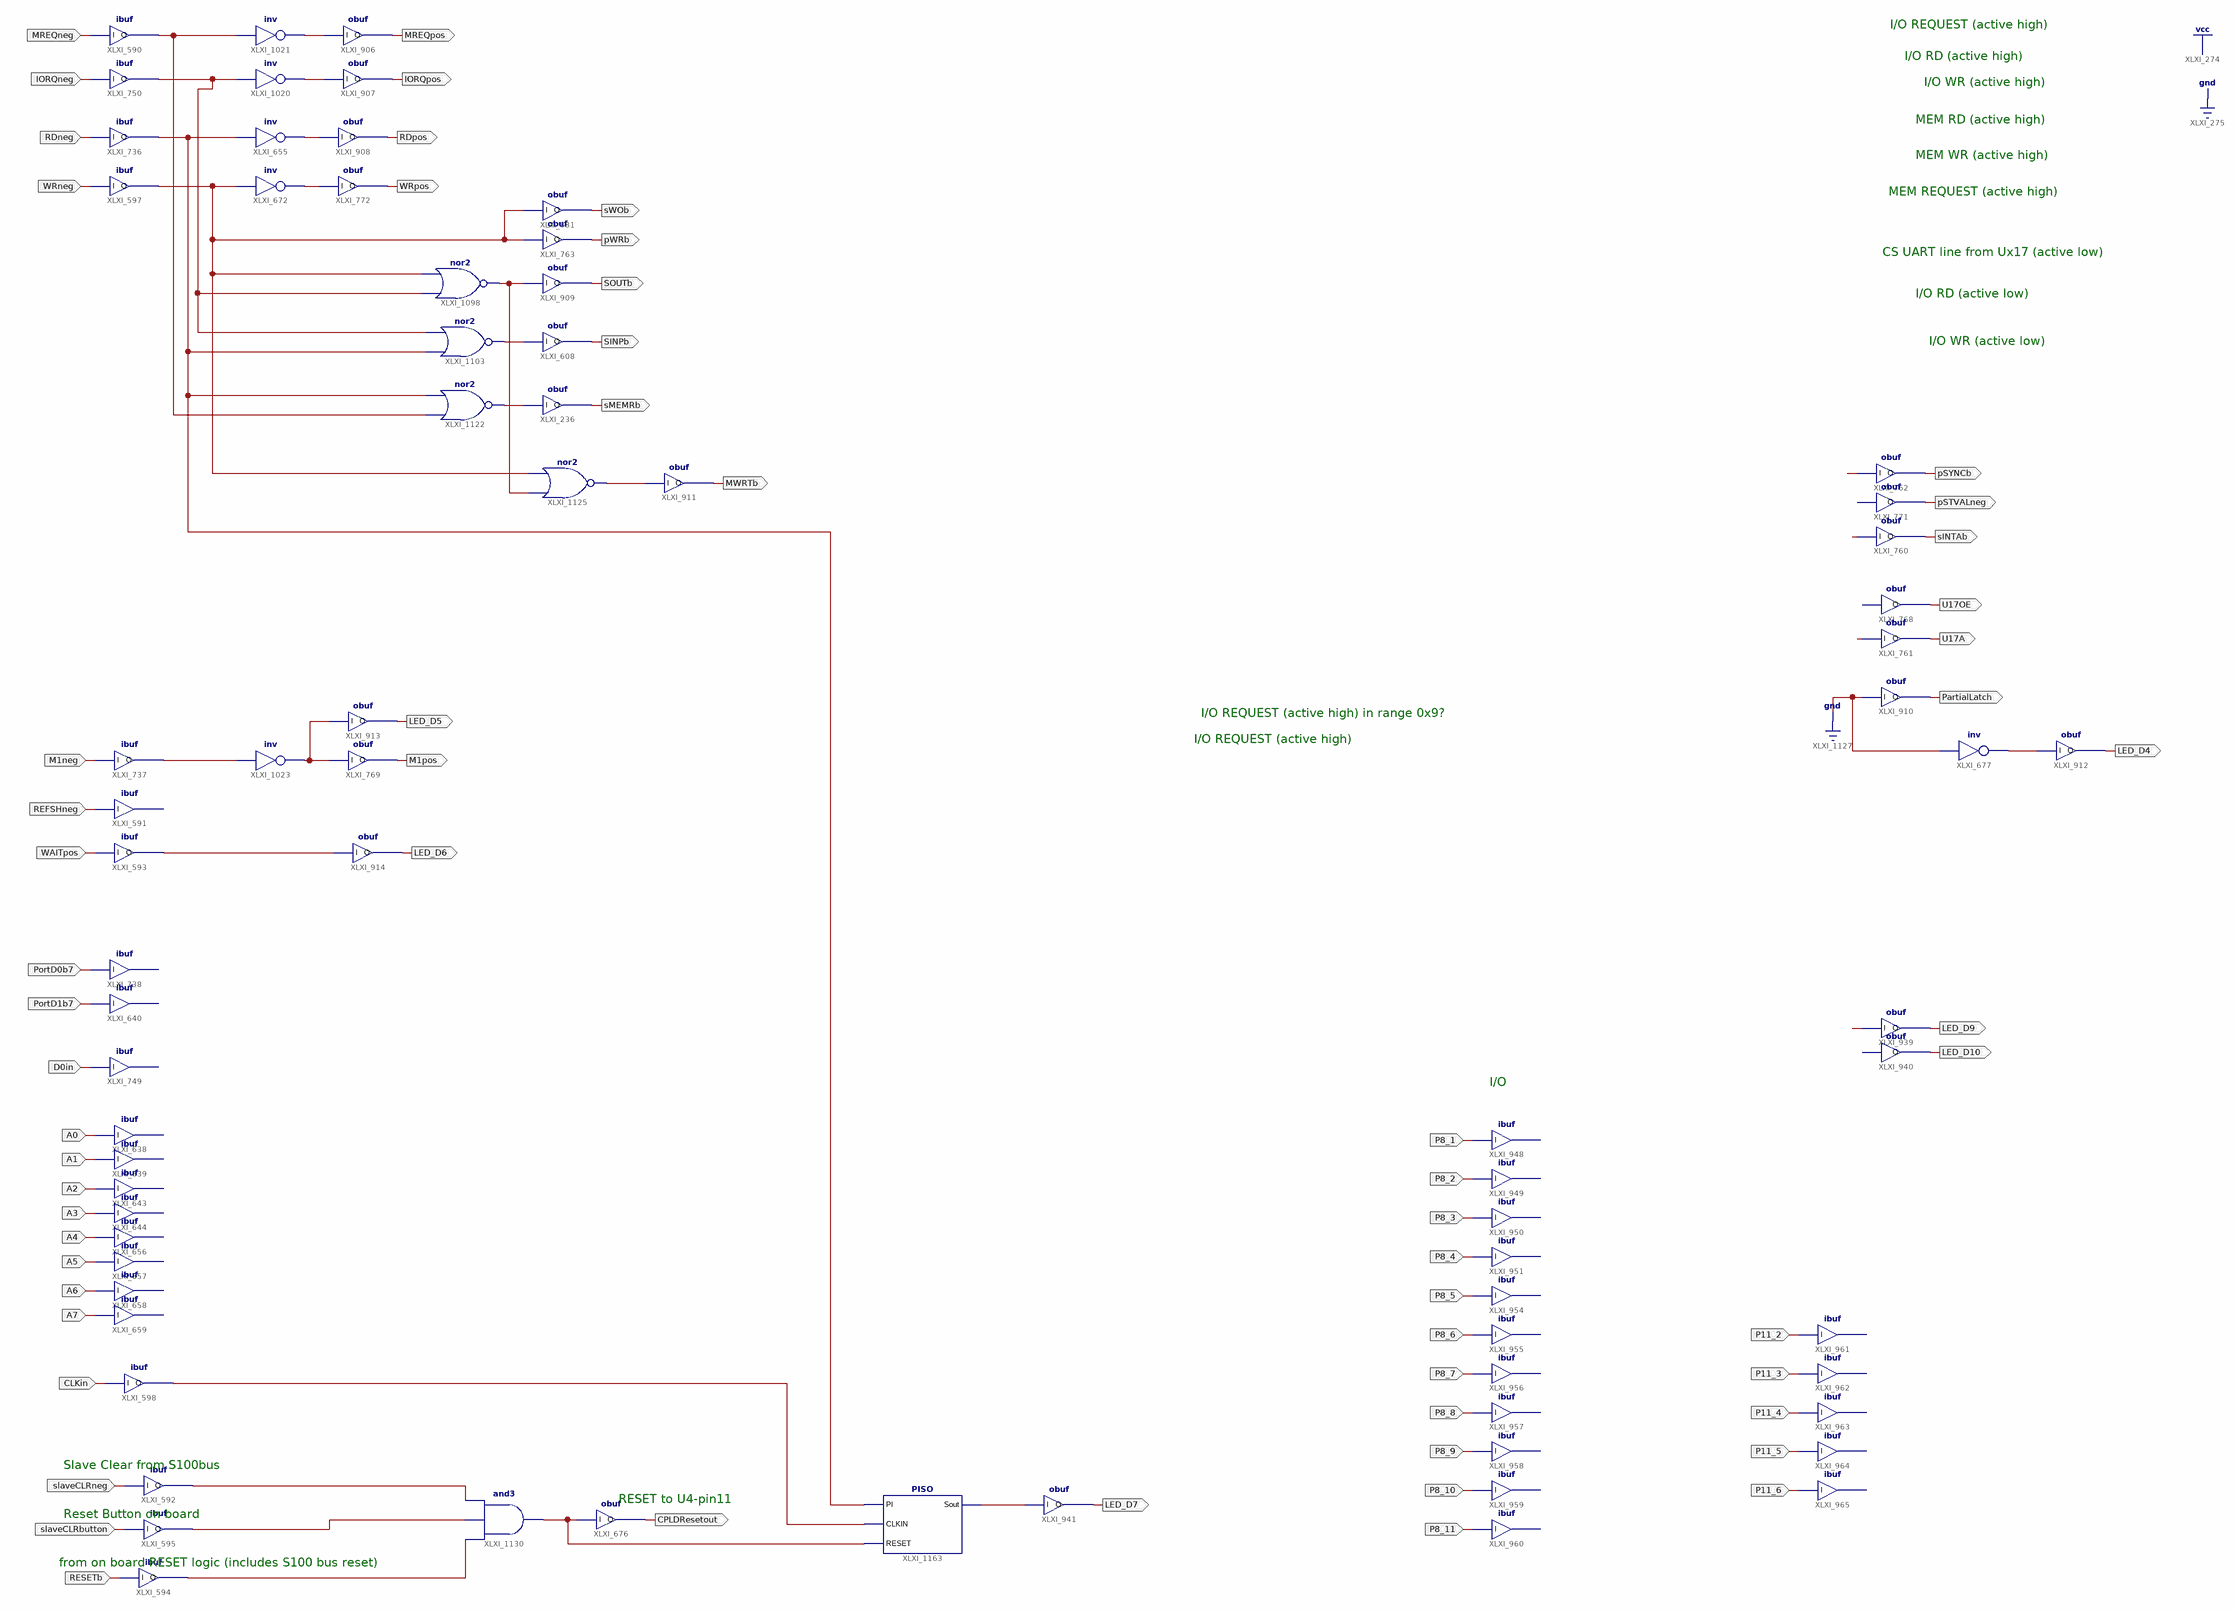
[diagram p0: schematic sheet 1]
// Xilinx ISE schematic IC1v1.sch (xc9500) as structural Verilog: 74 symbols, 62 ports
module IC1v1 (
  input  slaveCLRneg,
  input  slaveCLRbutton,
  input  RESETb,
  input  RDneg,
  input  IORQneg,
  input  WRneg,
  input  MREQneg,
  input  CLKin,
  input  A0,
  input  A1,
  input  A2,
  input  A3,
  input  A4,
  input  A5,
  input  A6,
  input  A7,
  input  D0in,
  input  PortD0b7,
  input  PortD1b7,
  input  M1neg,
  input  REFSHneg,
  input  WAITpos,
  input  P11_2,
  input  P11_3,
  input  P11_4,
  input  P11_5,
  input  P11_6,
  input  P8_1,
  input  P8_2,
  input  P8_3,
  input  P8_4,
  input  P8_5,
  input  P8_6,
  input  P8_7,
  input  P8_8,
  input  P8_9,
  input  P8_10,
  input  P8_11,
  output CPLDResetout,
  output PartialLatch,
  output LED_D9,
  output LED_D10,
  output RDpos,
  output WRpos,
  output MREQpos,
  output IORQpos,
  output pSYNCb,
  output pSTVALneg,
  output U17OE,
  output U17A,
  output sINTAb,
  output SOUTb,
  output SINPb,
  output M1pos,
  output sMEMRb,
  output pWRb,
  output MWRTb,
  output sWOb,
  output LED_D4,
  output LED_D5,
  output LED_D6,
  output LED_D7
);

  wire XLXN_1060, XLXN_1061, XLXN_1062, XLXN_1220, XLXN_1226, XLXN_1265, XLXN_1337, XLXN_1356, XLXN_1357,
       XLXN_1359, XLXN_1360, XLXN_1465, XLXN_1466, XLXN_1487, XLXN_1489, XLXN_1493, XLXN_1498, XLXN_1499,
       XLXN_1500, XLXN_1501, XLXN_1508, XLXN_1509, XLXN_1516, XLXN_1541, XLXN_1542, XLXN_1543;

  not XLXI_672 (XLXN_1359, XLXN_1498);
  not XLXI_655 (XLXN_1337, XLXN_1466);
  ibuf XLXI_592 (.I(slaveCLRneg), .O(XLXN_1499));
  ibuf XLXI_595 (.I(slaveCLRbutton), .O(XLXN_1500));
  obuf XLXI_676 (.I(XLXN_1542), .O(CPLDResetout));
  obuf XLXI_910 (.I(1'b0), .O(PartialLatch));
  obuf XLXI_939 (.I(XLXN_1265), .O(LED_D9));
  obuf XLXI_940 (.O(LED_D10));  // open: I
  not XLXI_677 (XLXN_1508, 1'b0);
  ibuf XLXI_594 (.I(RESETb), .O(XLXN_1501));
  ibuf XLXI_736 (.I(RDneg), .O(XLXN_1466));
  obuf XLXI_908 (.I(XLXN_1337), .O(RDpos));
  ibuf XLXI_750 (.I(IORQneg), .O(XLXN_1357));
  ibuf XLXI_597 (.I(WRneg), .O(XLXN_1498));
  obuf XLXI_772 (.I(XLXN_1359), .O(WRpos));
  obuf XLXI_906 (.I(XLXN_1356), .O(MREQpos));
  obuf XLXI_907 (.I(XLXN_1220), .O(IORQpos));
  not XLXI_1020 (XLXN_1220, XLXN_1357);
  not XLXI_1021 (XLXN_1356, XLXN_1487);
  ibuf XLXI_590 (.I(MREQneg), .O(XLXN_1487));
  obuf XLXI_762 (.I(XLXN_1062), .O(pSYNCb));
  obuf XLXI_771 (.O(pSTVALneg));  // open: I
  obuf XLXI_768 (.O(U17OE));  // open: I
  obuf XLXI_761 (.I(XLXN_1061), .O(U17A));
  obuf XLXI_760 (.I(XLXN_1060), .O(sINTAb));
  nor XLXI_1098 (XLXN_1493, XLXN_1357, XLXN_1498);
  obuf XLXI_909 (.I(XLXN_1493), .O(SOUTb));
  nor XLXI_1103 (XLXN_1465, XLXN_1466, XLXN_1357);
  obuf XLXI_608 (.I(XLXN_1465), .O(SINPb));
  ibuf XLXI_598 (.I(CLKin), .O(XLXN_1543));
  ibuf XLXI_638 (.I(A0));  // open: O
  ibuf XLXI_639 (.I(A1));  // open: O
  ibuf XLXI_643 (.I(A2));  // open: O
  ibuf XLXI_644 (.I(A3));  // open: O
  ibuf XLXI_656 (.I(A4));  // open: O
  ibuf XLXI_657 (.I(A5));  // open: O
  ibuf XLXI_658 (.I(A6));  // open: O
  ibuf XLXI_659 (.I(A7));  // open: O
  ibuf XLXI_749 (.I(D0in));  // open: O
  ibuf XLXI_738 (.I(PortD0b7));  // open: O
  ibuf XLXI_640 (.I(PortD1b7));  // open: O
  ibuf XLXI_737 (.I(M1neg), .O(XLXN_1360));
  obuf XLXI_769 (.I(XLXN_1509), .O(M1pos));
  not XLXI_1023 (XLXN_1509, XLXN_1360);
  ibuf XLXI_591 (.I(REFSHneg));  // open: O
  ibuf XLXI_593 (.I(WAITpos), .O(XLXN_1516));
  nor XLXI_1122 (XLXN_1489, XLXN_1487, XLXN_1466);
  obuf XLXI_236 (.I(XLXN_1489), .O(sMEMRb));
  obuf XLXI_763 (.I(XLXN_1498), .O(pWRb));
  nor XLXI_1125 (XLXN_1226, XLXN_1493, XLXN_1498);
  obuf XLXI_911 (.I(XLXN_1226), .O(MWRTb));
  obuf XLXI_581 (.I(XLXN_1498), .O(sWOb));
  and XLXI_1130 (XLXN_1542, XLXN_1501, XLXN_1500, XLXN_1499);
  obuf XLXI_912 (.I(XLXN_1508), .O(LED_D4));
  obuf XLXI_913 (.I(XLXN_1509), .O(LED_D5));
  obuf XLXI_914 (.I(XLXN_1516), .O(LED_D6));
  ibuf XLXI_961 (.I(P11_2));  // open: O
  ibuf XLXI_962 (.I(P11_3));  // open: O
  ibuf XLXI_963 (.I(P11_4));  // open: O
  ibuf XLXI_964 (.I(P11_5));  // open: O
  ibuf XLXI_965 (.I(P11_6));  // open: O
  ibuf XLXI_948 (.I(P8_1));  // open: O
  ibuf XLXI_949 (.I(P8_2));  // open: O
  ibuf XLXI_950 (.I(P8_3));  // open: O
  ibuf XLXI_951 (.I(P8_4));  // open: O
  ibuf XLXI_954 (.I(P8_5));  // open: O
  ibuf XLXI_955 (.I(P8_6));  // open: O
  ibuf XLXI_956 (.I(P8_7));  // open: O
  ibuf XLXI_957 (.I(P8_8));  // open: O
  ibuf XLXI_958 (.I(P8_9));  // open: O
  ibuf XLXI_959 (.I(P8_10));  // open: O
  ibuf XLXI_960 (.I(P8_11));  // open: O
  obuf XLXI_941 (.I(XLXN_1541), .O(LED_D7));
  PISO XLXI_1163 (.CLKIN(XLXN_1543), .PI(XLXN_1466), .RESET(XLXN_1542), .Sout(XLXN_1541));

  // Notes on the sheet:
  //   I/O REQUEST (active high)
  //   I/O RD (active high)
  //   I/O WR (active high)
  //   MEM RD (active high)
  //   MEM WR (active high)
  //   MEM REQUEST (active high)
  //   CS UART line from Ux17 (active low)
  //   I/O RD (active low)
  //   I/O WR (active low)
  //   I/O REQUEST (active high) in range 0x9?
  //   I/O REQUEST (active high)
  //   I/O
  //   Slave Clear from S100bus
  //   RESET to U4-pin11
  //   Reset Button on board
  //   from on board RESET logic (includes S100 bus reset)
endmodule
